# Altium schematic sheet FPGA_B34.SchDoc: TE0722
size A4; Organization: Trenz Electronic GmbH; DocumentNumber: 2; Revision: 01; SheetNumber: 2; SheetTotal: 8; Date: 07.11.2014; PageSetup: Record=PageOptions|CenterHorizontal=True|CenterVertical=True|PrintScale=0.96|XCorrection=1.00|YCorrection=1.00|PrintKind=0|BorderSize=5000000|LeftOffset=0|BottomOffset=0|Orientation=2|PaperLength=1000|PaperWidth=1000|Scale=100|PaperSource=7|PrintQuality=-4|MediaType=1|DitherType=10|PaperKind=A4|PrintScaleMode=1
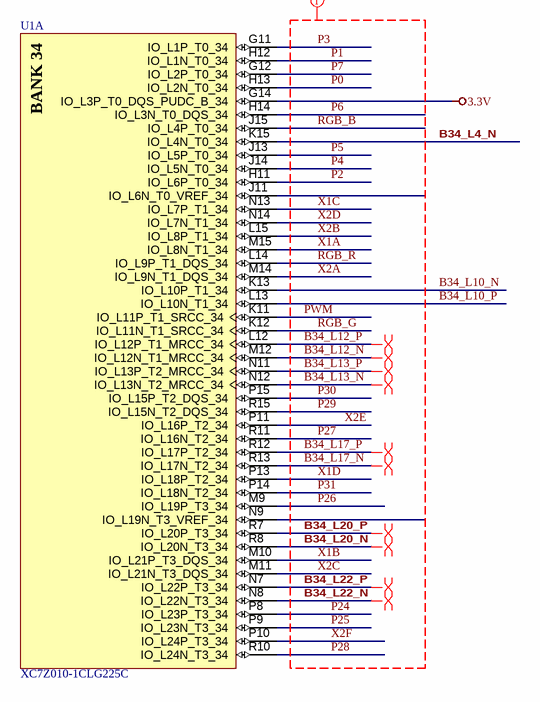
[diagram p0: FPGA_B34.SchDoc]

## Parts
U1  XC7Z010-1CLG225C  [CLG225]  (part A of 8)

## Nets
3.3V: U1.G14(IO_L3P_T0_DQS_PUDC_B_34)
B34_L4_N: U1.K15(IO_L4N_T0_34)
B34_L10_N: U1.K13(IO_L10P_T1_34)
B34_L10_P: U1.L13(IO_L10N_T1_34)
B34_L12_N: U1.M12(IO_L12N_T1_MRCC_34)
B34_L12_P: U1.L12(IO_L12P_T1_MRCC_34)
B34_L13_N: U1.N12(IO_L13N_T2_MRCC_34)
B34_L13_P: U1.N11(IO_L13P_T2_MRCC_34)
B34_L17_N: U1.R13(IO_L17N_T2_34)
B34_L17_P: U1.R12(IO_L17P_T2_34)
B34_L20_N: U1.R8(IO_L20N_T3_34)
B34_L20_P: U1.R7(IO_L20P_T3_34)
B34_L22_N: U1.N8(IO_L22N_T3_34)
B34_L22_P: U1.N7(IO_L22P_T3_34)
P0: U1.H13(IO_L2N_T0_34)
P1: U1.H12(IO_L1N_T0_34)
P2: U1.H11(IO_L6P_T0_34)
P3: U1.G11(IO_L1P_T0_34)
P4: U1.J14(IO_L5N_T0_34)
P5: U1.J13(IO_L5P_T0_34)
P6: U1.H14(IO_L3N_T0_DQS_34)
P7: U1.G12(IO_L2P_T0_34)
P24: U1.P8(IO_L23P_T3_34)
P25: U1.P9(IO_L23N_T3_34)
P26: U1.M9(IO_L19P_T3_34)
P27: U1.R11(IO_L16N_T2_34)
P28: U1.R10(IO_L24N_T3_34)
P29: U1.R15(IO_L15N_T2_DQS_34)
P30: U1.P15(IO_L15P_T2_DQS_34)
P31: U1.P14(IO_L18N_T2_34)
PWM: U1.K11(IO_L11P_T1_SRCC_34)
RGB_B: U1.J15(IO_L4P_T0_34)
RGB_G: U1.K12(IO_L11N_T1_SRCC_34)
RGB_R: U1.L14(IO_L9P_T1_DQS_34)
X1A: U1.M15(IO_L8N_T1_34)
X1B: U1.M10(IO_L21P_T3_DQS_34)
X1C: U1.N13(IO_L7P_T1_34)
X1D: U1.P13(IO_L18P_T2_34)
X2A: U1.M14(IO_L9N_T1_DQS_34)
X2B: U1.L15(IO_L8P_T1_34)
X2C: U1.M11(IO_L21N_T3_DQS_34)
X2D: U1.N14(IO_L7N_T1_34)
X2E: U1.P11(IO_L16P_T2_34)
X2F: U1.P10(IO_L24P_T3_34)

Not connected (* = marked no-connect by the designer): U1 J11(IO_L6N_T0_VREF_34) N9(IO_L19N_T3_VREF_34)

## Layout directives
net class B34: B34_L12_N, B34_L12_P, B34_L13_N, B34_L13_P, B34_L17_N, B34_L17_P, B34_L20_N, B34_L20_P, B34_L22_N, B34_L22_P, P0, P1, P2, P3, P4, P5, P6, P7, P24, P25, P26, P27, P28, P29, P30, P31, PWM, RGB_B, RGB_G, RGB_R, X1A, X1B, X1C, X1D, X2A, X2B, X2C, X2D, X2E, X2F
differential pair: B34_L12_N, B34_L12_P, B34_L13_N, B34_L13_P, B34_L17_N, B34_L17_P, B34_L20_N, B34_L20_P, B34_L22_N, B34_L22_P

## Notes on the sheet
- Title:
- Nummer:
- Rev.
- Datum:
- A4
- Zeichner:
- Blatt
- von
- Filename:
- (in symbol 26308, part A) BANK 34

## Library data of the parts
U1 = 26308: AN: 26308; Mixed: SMT; Case: CLG225; HelpURL: B:\AD\adlib\datasheet\XC7\Zynq